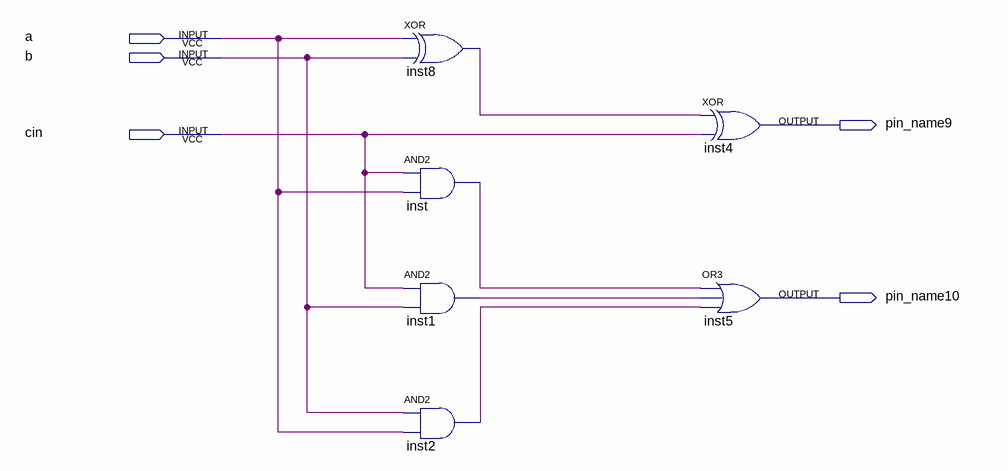
[diagram p0: schematic sheet]
// Quartus schematic qjq2.bdf as structural Verilog: 6 symbols, 5 pins
module qjq2 (
  input  a,
  input  b,
  input  cin,
  output pin_name9,
  output pin_name10
);

  wire inst1_out, inst2_out, inst8_out, inst_out;

  xor inst8 (inst8_out, a, b);
  and inst (inst_out, cin, a);
  and inst1 (inst1_out, cin, b);
  and inst2 (inst2_out, b, a);
  xor inst4 (pin_name9, inst8_out, cin);
  or inst5 (pin_name10, inst_out, inst1_out, inst2_out);
endmodule
